# EAGLE design le_strum (EAGLE 5.10)
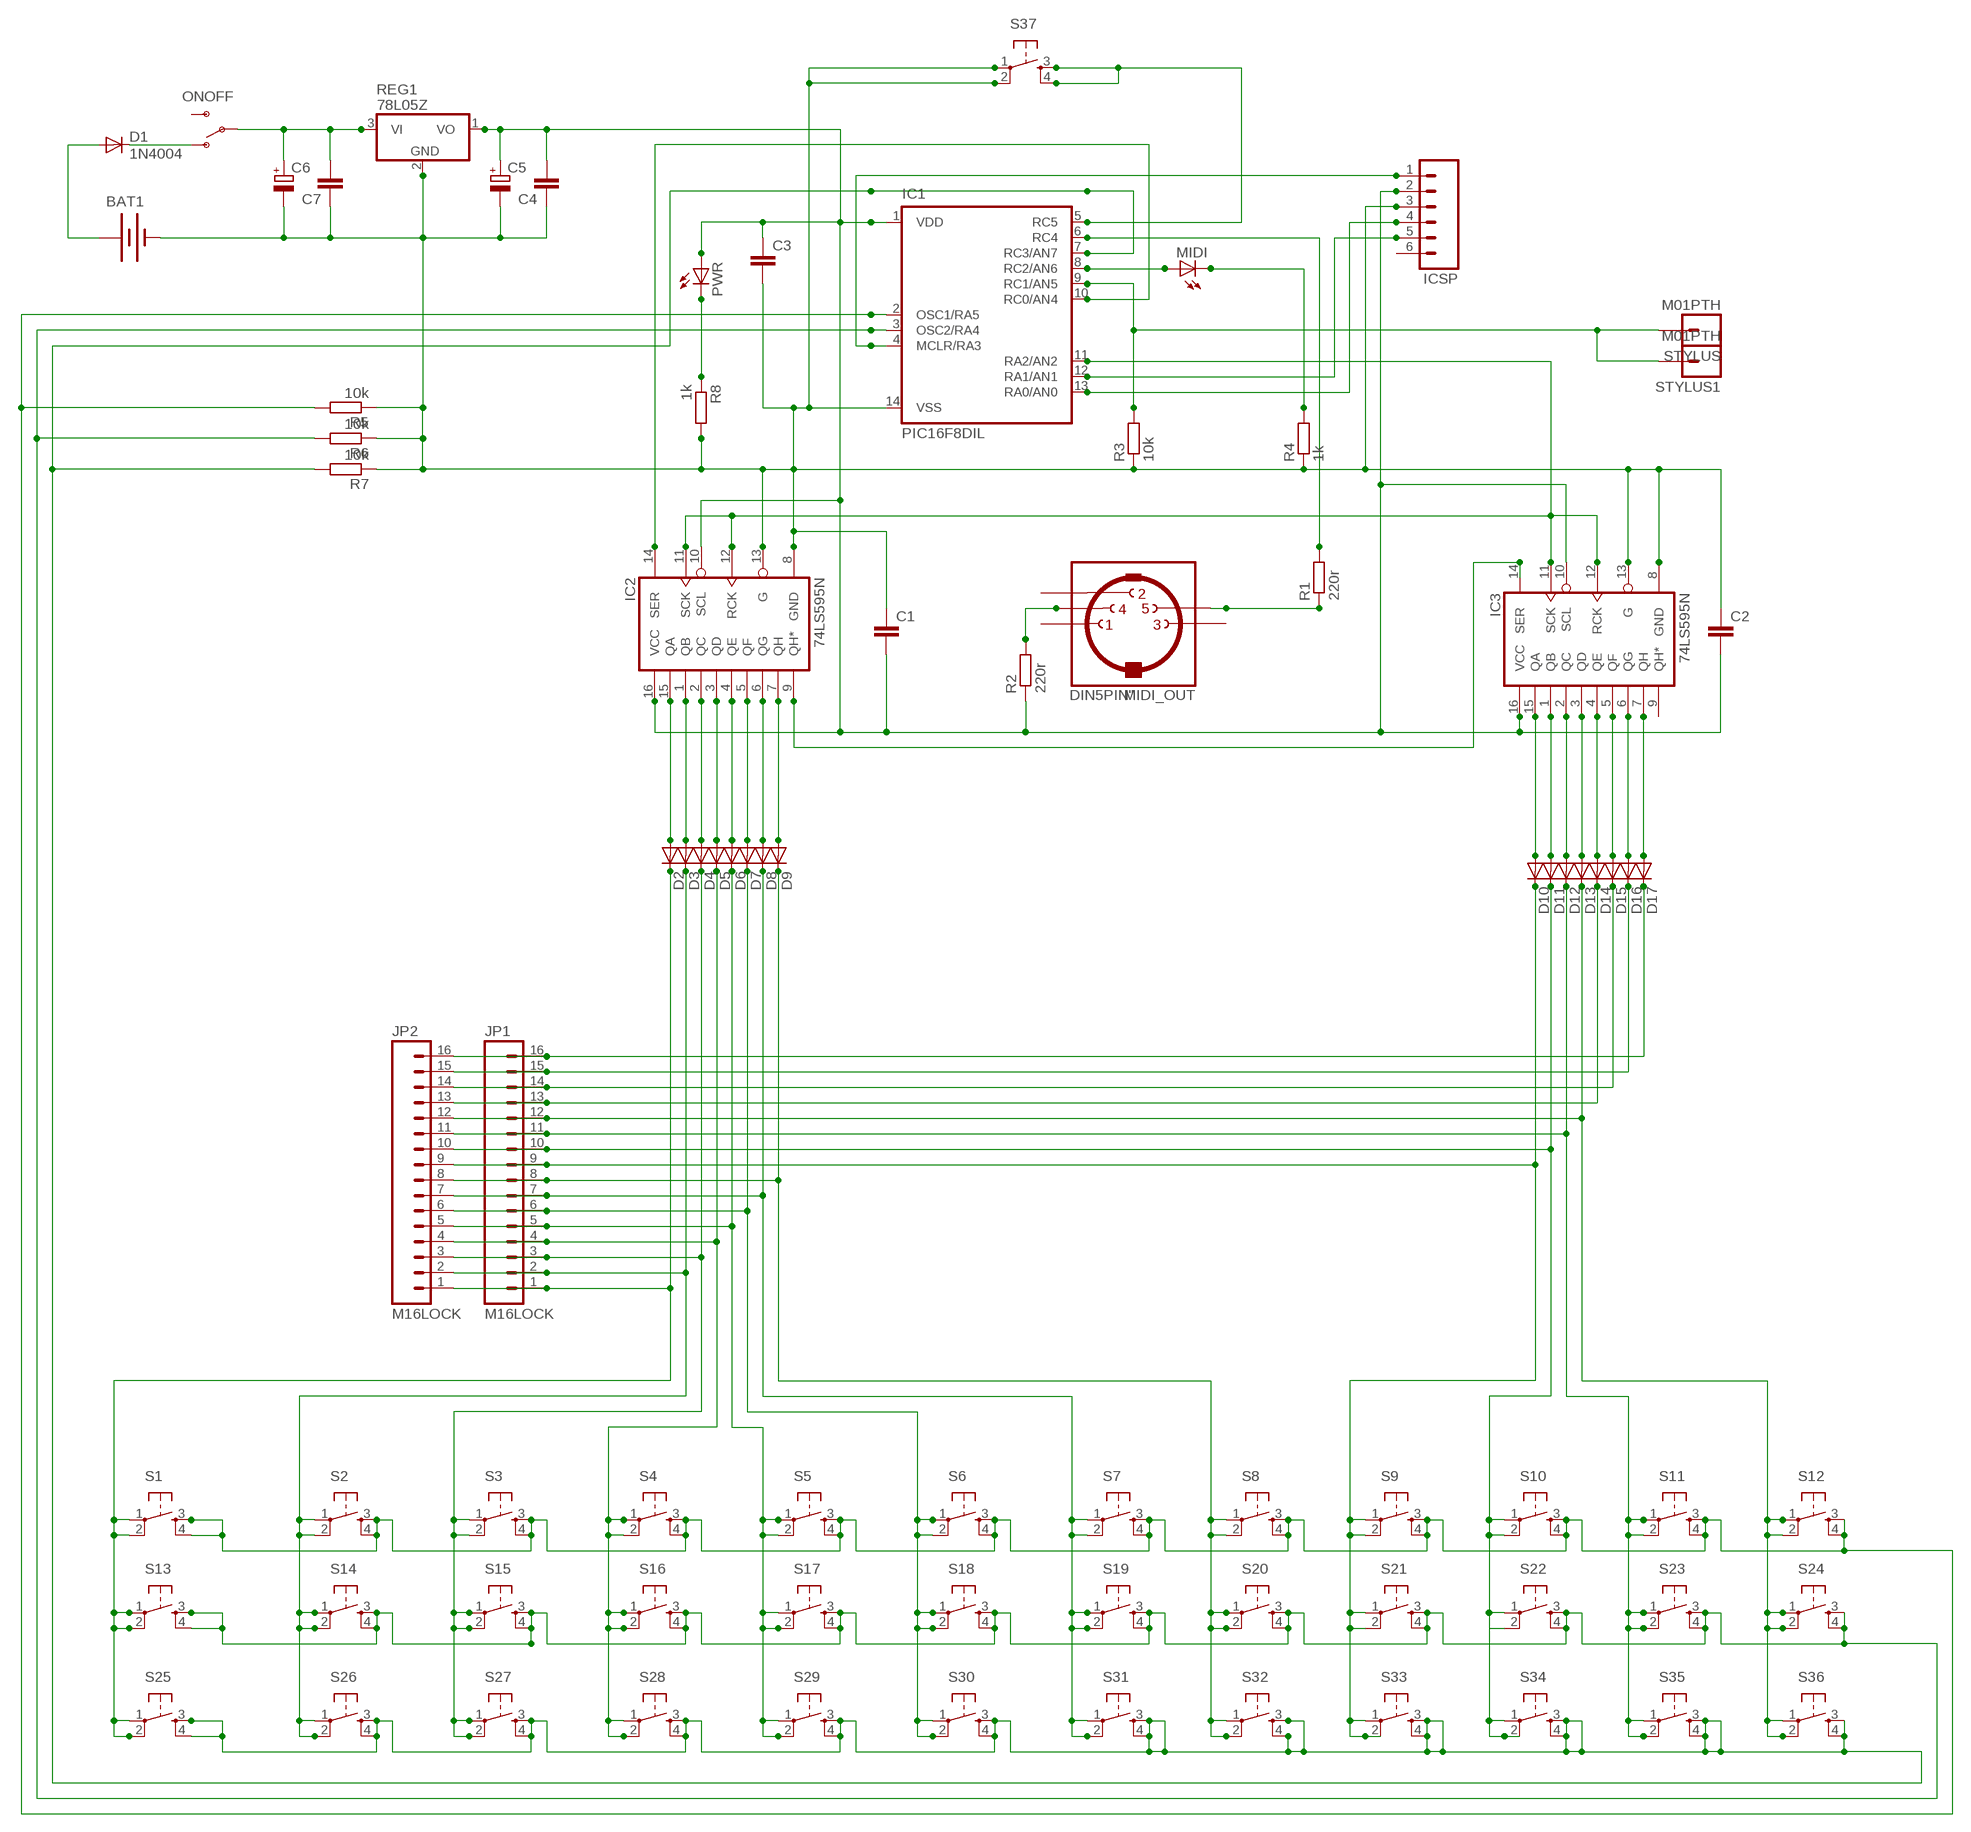
[diagram p0: schematic, sheet 1]

## Parts
BAT1  BATTERY2HOLES  [PP3_BATTERBOX2]
C1  C-EU025-024X044  [C025-024X044]
C2  C-EU025-024X044  [C025-024X044]
C3  C-EU025-024X044  [C025-024X044]
C4  C-EU025-024X044  [C025-024X044]
C5  CPOL-EUE2-5  [E2-5]
C6  CPOL-EUE2-5  [E2-5]
C7  C-EU025-024X044  [C025-024X044]
D1  1N4004  [DO41-10]
D2  DIODE-D-5  [D-5]
D3  DIODE-D-5  [D-5]
D4  DIODE-D-5  [D-5]
D5  DIODE-D-5  [D-5]
D6  DIODE-D-5  [D-5]
D7  DIODE-D-5  [D-5]
D8  DIODE-D-5  [D-5]
D9  DIODE-D-5  [D-5]
D10  DIODE-D-5  [D-5]
D11  DIODE-D-5  [D-5]
D12  DIODE-D-5  [D-5]
D13  DIODE-D-5  [D-5]
D14  DIODE-D-5  [D-5]
D15  DIODE-D-5  [D-5]
D16  DIODE-D-5  [D-5]
D17  DIODE-D-5  [D-5]
IC1  PIC16F8DIL  [DIL14]
IC2  74LS595N  [DIL16]
IC3  74LS595N  [DIL16]
ICSP  M06SIP  [1X06]
JP1  M16LOCK  [1X16_LOCK]
JP2  M16LOCK  [1X16_LOCK]
MIDI  LED3MM  [LED3MM]
MIDI_OUT  DIN5PIN"  [TRUCONN90]
ONOFF  SWITCH-SPSTPTH  [SWITCH-SPDT]
PWR  LED3MM  [LED3MM]
R1  220r  R-EU_0207/7  [0207/7]
R2  220r  R-EU_0207/7  [0207/7]
R3  10k  R-EU_0207/7  [0207/7]
R4  1k  R-EU_0207/7  [0207/7]
R5  10k  R-EU_0207/7  [0207/7]
R6  10k  R-EU_0207/7  [0207/7]
R7  10k  R-EU_0207/7  [0207/7]
R8  1k  R-EU_0207/7  [0207/7]
REG1  78L05Z  [TO92]
S1  TAC_SWITCHPTH  [TACTILE-PTH]
S2  TAC_SWITCHPTH  [TACTILE-PTH]
S3  TAC_SWITCHPTH  [TACTILE-PTH]
S4  TAC_SWITCHPTH  [TACTILE-PTH]
S5  TAC_SWITCHPTH  [TACTILE-PTH]
S6  TAC_SWITCHPTH  [TACTILE-PTH]
S7  TAC_SWITCHPTH  [TACTILE-PTH]
S8  TAC_SWITCHPTH  [TACTILE-PTH]
S9  TAC_SWITCHPTH  [TACTILE-PTH]
S10  TAC_SWITCHPTH  [TACTILE-PTH]
S11  TAC_SWITCHPTH  [TACTILE-PTH]
S12  TAC_SWITCHPTH  [TACTILE-PTH]
S13  TAC_SWITCHPTH  [TACTILE-PTH]
S14  TAC_SWITCHPTH  [TACTILE-PTH]
S15  TAC_SWITCHPTH  [TACTILE-PTH]
S16  TAC_SWITCHPTH  [TACTILE-PTH]
S17  TAC_SWITCHPTH  [TACTILE-PTH]
S18  TAC_SWITCHPTH  [TACTILE-PTH]
S19  TAC_SWITCHPTH  [TACTILE-PTH]
S20  TAC_SWITCHPTH  [TACTILE-PTH]
S21  TAC_SWITCHPTH  [TACTILE-PTH]
S22  TAC_SWITCHPTH  [TACTILE-PTH]
S23  TAC_SWITCHPTH  [TACTILE-PTH]
S24  TAC_SWITCHPTH  [TACTILE-PTH]
S25  TAC_SWITCHPTH  [TACTILE-PTH]
S26  TAC_SWITCHPTH  [TACTILE-PTH]
S27  TAC_SWITCHPTH  [TACTILE-PTH]
S28  TAC_SWITCHPTH  [TACTILE-PTH]
S29  TAC_SWITCHPTH  [TACTILE-PTH]
S30  TAC_SWITCHPTH  [TACTILE-PTH]
S31  TAC_SWITCHPTH  [TACTILE-PTH]
S32  TAC_SWITCHPTH  [TACTILE-PTH]
S33  TAC_SWITCHPTH  [TACTILE-PTH]
S34  TAC_SWITCHPTH  [TACTILE-PTH]
S35  TAC_SWITCHPTH  [TACTILE-PTH]
S36  TAC_SWITCHPTH  [TACTILE-PTH]
S37  TAC_SWITCHPTH  [TACTILE-PTH]
STYLUS  M01PTH  [1X01]
STYLUS1  M01PTH  [1X01]

## Nets
CARRY: IC2.9(QH*) IC3.14(SER)
CLK: IC1.11(RA2/AN2) IC2.11(SCK) IC2.12(RCK) IC3.11(SCK) IC3.12(RCK)
GND: BAT1.0V(-) C1.1 C2.1 C3.2 C4.1 C5.- C6.- C7.1 IC1.14(VSS) IC2.8(GND) IC2.13(G) IC3.8(GND) IC3.13(G) ICSP.3 R3.1 R4.1 R5.1 R6.1 R7.1 R8.2 REG1.2(GND) S37.1 S37.2
LINE1: D2.C JP1.1 JP2.1 S1.1 S1.2 S13.1 S13.2 S25.1 S25.2
LINE2: D3.C JP1.2 JP2.2 S2.1 S2.2 S14.1 S14.2 S26.1 S26.2
LINE3: D4.C JP1.3 JP2.3 S3.1 S3.2 S15.1 S15.2 S27.1 S27.2
LINE4: D5.C JP1.4 JP2.4 S4.1 S4.2 S16.1 S16.2 S28.1 S28.2
LINE5: D6.C JP1.5 JP2.5 S5.1 S5.2 S17.1 S17.2 S29.1 S29.2
LINE6: D7.C JP1.6 JP2.6 S6.1 S6.2 S18.1 S18.2 S30.1 S30.2
LINE7: D8.C JP1.7 JP2.7 S7.1 S7.2 S19.1 S19.2 S31.1 S31.2
LINE8: D9.C JP1.8 JP2.8 S8.1 S8.2 S20.1 S20.2 S32.1 S32.2
LINE9: D10.C JP1.9 JP2.9 S9.1 S9.2 S21.1 S21.2 S33.1 S33.2
LINE10: D11.C JP1.10 JP2.10 S10.1 S10.2 S22.1 S22.2 S34.1 S34.2
LINE11: D12.C JP1.11 JP2.11 S11.1 S11.2 S23.1 S23.2 S35.1 S35.2
LINE12: D13.C JP1.12 JP2.12 S12.1 S12.2 S24.1 S24.2 S36.1 S36.2
LINE13: D14.C JP1.13 JP2.13
LINE14: D15.C JP1.14 JP2.14
LINE15: D16.C JP1.15 JP2.15
LINE16: D17.C JP1.16 JP2.16
N$1: IC1.2(OSC1/RA5) R5.2 S1.3 S1.4 S2.3 S2.4 S3.3 S3.4 S4.3 S4.4 S5.3 S5.4 S6.3 S6.4 S7.3 S7.4 S8.3 S8.4 S9.3 S9.4 S10.3 S10.4 S11.3 S11.4 S12.3 S12.4
N$2: BAT1.9V(+) D1.A
N$3: D1.C ONOFF.1(O)
N$4: IC1.13(RA0/AN0) ICSP.4
N$5: D2.A IC2.15(QA)
N$6: D3.A IC2.1(QB)
N$7: D4.A IC2.2(QC)
N$8: D5.A IC2.3(QD)
N$9: D6.A IC2.4(QE)
N$10: D7.A IC2.5(QF)
N$11: D8.A IC2.6(QG)
N$12: IC1.9(RC1/AN5) R3.2 STYLUS1.1 STYLUS.1
N$13: D9.A IC2.7(QH)
N$14: D10.A IC3.15(QA)
N$15: D11.A IC3.1(QB)
N$16: D12.A IC3.2(QC)
N$17: D13.A IC3.3(QD)
N$18: D14.A IC3.4(QE)
N$19: D15.A IC3.5(QF)
N$20: D16.A IC3.6(QG)
N$21: D17.A IC3.7(QH)
N$22: IC1.5(RC5) S37.3 S37.4
N$23: IC1.7(RC3/AN7) R7.2 S25.3 S25.4 S26.3 S26.4 S27.3 S27.4 S28.3 S28.4 S29.3 S29.4 S30.3 S30.4 S31.3 S31.4 S32.3 S32.4 S33.3 S33.4 S34.3 S34.4 S35.3 S35.4 S36.3 S36.4
N$34: IC1.10(RC0/AN4) IC2.14(SER)
N$35: IC1.4(MCLR/RA3) ICSP.1
N$38: IC1.8(RC2/AN6) MIDI.A
N$42: IC1.12(RA1/AN1) ICSP.5
N$44: MIDI_OUT.5 R1.1
N$46: IC1.6(RC4) R1.2
N$48: MIDI_OUT.4 R2.2
N$50: IC1.3(OSC2/RA4) R6.2 S13.3 S13.4 S14.3 S14.4 S15.3 S15.4 S16.3 S16.4 S17.3 S17.4 S18.3 S18.4 S19.3 S19.4 S20.3 S20.4 S21.3 S21.4 S22.3 S22.4 S23.3 S23.4 S24.3 S24.4
N$52: MIDI.K(C) R4.2
N$54: PWR.K(C) R8.1
N$59: C6.+ C7.2 ONOFF.2(P) REG1.3(VI)
VCC: C1.2 C2.2 C3.1 C4.2 C5.+ IC1.1(VDD) IC2.10(SCL) IC2.16(VCC) IC3.10(SCL) IC3.16(VCC) ICSP.2 PWR.A R2.1 REG1.1(VO)
Unconnected: IC3.9(QH*) ICSP.6 MIDI_OUT.1 MIDI_OUT.2 MIDI_OUT.3 ONOFF.3(S)

## Library data of the parts
BAT1 = jasons_stuff:BATTERY: Battery Holders Various common sizes : AA, AAA, 20mm coin cell and 12mm coin cell.
C1-C4 C7 = rcl:C-EU: CAPACITOR, European symbol
C5 C6 = rcl:CPOL-EU: POLARIZED CAPACITOR, European symbol
D1 = diode:1N4004: DIODE general purpose rectifier, 1 A
D2-D17 = diode:DIODE-: DIODE
IC1 = pic16f6xx_14pin:PIC16F8*: MICROCONTROLLER 14-Pin, 8-Bit PIC16F8X Family - CMOS Flash Pin Compatible : 16F630, 16F676, 16F684, 16F688 Keywords: PIC16F630, PIC16F676, PIC16F684, PIC16F688
IC2 IC3 = SparkFun:74*595: 8-bit SHIFT REGISTER, output latch
ICSP = SparkFun:M06: Header 6 Standard 6-pin 0.1" header. Use with straight break away headers (SKU : PRT-00116), right angle break away headers (PRT-00553), swiss pins (PRT-00743), machine pins (PRT-00117), and female headers (PRT-00115). Molex polarized connector foot print use with SKU : PRT-08094 with associated crimp pins and housings. NOTES ON THE VARIANTS LOCK and LOCK_LONGPADS... This footprint was designed to help hold the alignment of a through-hole component (i.e. 6-pin header) while soldering it into place. You may notice that each hole has been shifted either up or down by 0.005 of an inch from it's more standard position (which is a perfectly straight line). This slight alteration caused the pins (the squares in the middle) to touch the edges of the holes. Because they are alternating, it causes a "brace" to hold the component in place. 0.005 has proven to be the perfect amount of "off-center" position when using our standard breakaway headers. Although looks a little odd when you look at the bare footprint, once you have a header in there, the alteration is very hard to notice. Also, if you push a header all the way into place, it is covered up entirely on the bottom side. This idea of altering the position of holes to aid alignment will be further integrated into the Sparkfun Library for other footprints. It can help hold any component with 3 or more connection pins.
JP1 JP2 = SparkFun:M16
MIDI PWR = led:LED: LED OSRAM: - CHIPLED LG R971, LG N971, LY N971, LG Q971, LY Q971, LO R971, LY R971 LH N974, LH R974 LS Q976, LO Q976, LY Q976 LO Q996 - Hyper CHIPLED LW Q18S LB Q993, LB Q99A, LB R99A - SideLED LS A670, LO A670, LY A670, LG A670, LP A670 LB A673, LV A673, LT A673, LW A673 LH A674 LY A675 LS A676, LA A676, LO A676, LY A676, LW A676 LS A679, LY A679, LG A679 - Hyper Micro SIDELED® LS Y876, LA Y876, LO Y876, LY Y876 LT Y87S - SmartLED LW L88C, LW L88S LB L89C, LB L89S, LG L890 LS L89K, LO L89K, LY L89K LS L896, LA L896, LO L896, LY L896 - TOPLED LS T670, LO T670, LY T670, LG T670, LP T670 LSG T670, LSP T670, LSY T670, LOP T670, LYG T670 LG T671, LOG T671, LSG T671 LB T673, LV T673, LT T673, LW T673 LH T674 LS T676, LA T676, LO T676, LY T676, LB T676, LH T676, LSB T676, LW T676 LB T67C, LV T67C, LT T67C, LS T67K, LO T67K, LY T67K, LW E67C LS E67B, LA E67B, LO E67B, LY E67B, LB E67C, LV E67C, LT E67C LW T67C LS T679, LY T679, LG T679 LS T770, LO T770, LY T770, LG T770, LP T770 LB T773, LV T773, LT T773, LW T773 LH T774 LS E675, LA E675, LY E675, LS T675 LS T776, LA T776, LO T776, LY T776, LB T776 LHGB T686 LT T68C, LB T68C - Hyper Mini TOPLED® LB M676 - Mini TOPLED Santana® LG M470 LS M47K, LO M47K, LY M47K Source: http://www.osram.convergy.de LUXEON: - LUMILED® LXK2-PW12-R00, LXK2-PW12-S00, LXK2-PW14-U00, LXK2-PW14-V00 LXK2-PM12-R00, LXK2-PM12-S00, LXK2-PM14-U00 LXK2-PE12-Q00, LXK2-PE12-R00, LXK2-PE12-S00, LXK2-PE14-T00, LXK2-PE14-U00 LXK2-PB12-K00, LXK2-PB12-L00, LXK2-PB12-M00, LXK2-PB14-N00, LXK2-PB14-P00, LXK2-PB14-Q00 LXK2-PR12-L00, LXK2-PR12-M00, LXK2-PR14-Q00, LXK2-PR14-R00 LXK2-PD12-Q00, LXK2-PD12-R00, LXK2-PD12-S00 LXK2-PH12-R00, LXK2-PH12-S00 LXK2-PL12-P00, LXK2-PL12-Q00, LXK2-PL12-R00 Source: www.luxeon.com KINGBRIGHT: KA-3528ASYC Source: www.kingbright.com
MIDI_OUT = jasons_stuff:DIN5PIN: Female CONNECTOR 5 pins 90 deg. with shield, horizontal (DIN 41524)
ONOFF = SparkFun:SWITCH-SPST: SPST Switch Simple slide switch. Spark Fun Electronics SKU : COM-00102
R1-R8 = resistor:R-EU_: RESISTOR, European symbol
REG1 = adafruit:78*: Positive VOLTAGE REGULATOR Added bigger pads to the TO-92 package
S1-S37 = SparkFun:TAC_SWITCH: Momentary Switch Button commonly used for reset or general input. Spark Fun Electronics SKU : COM-00097
STYLUS STYLUS1 = SparkFun:M01: Header 1 Standard 1-pin 0.1" header. Use with straight break away headers (SKU : PRT-00116), right angle break away headers (PRT-00553), swiss pins (PRT-00743), machine pins (PRT-00117), and female headers (PRT-00115).

## Board
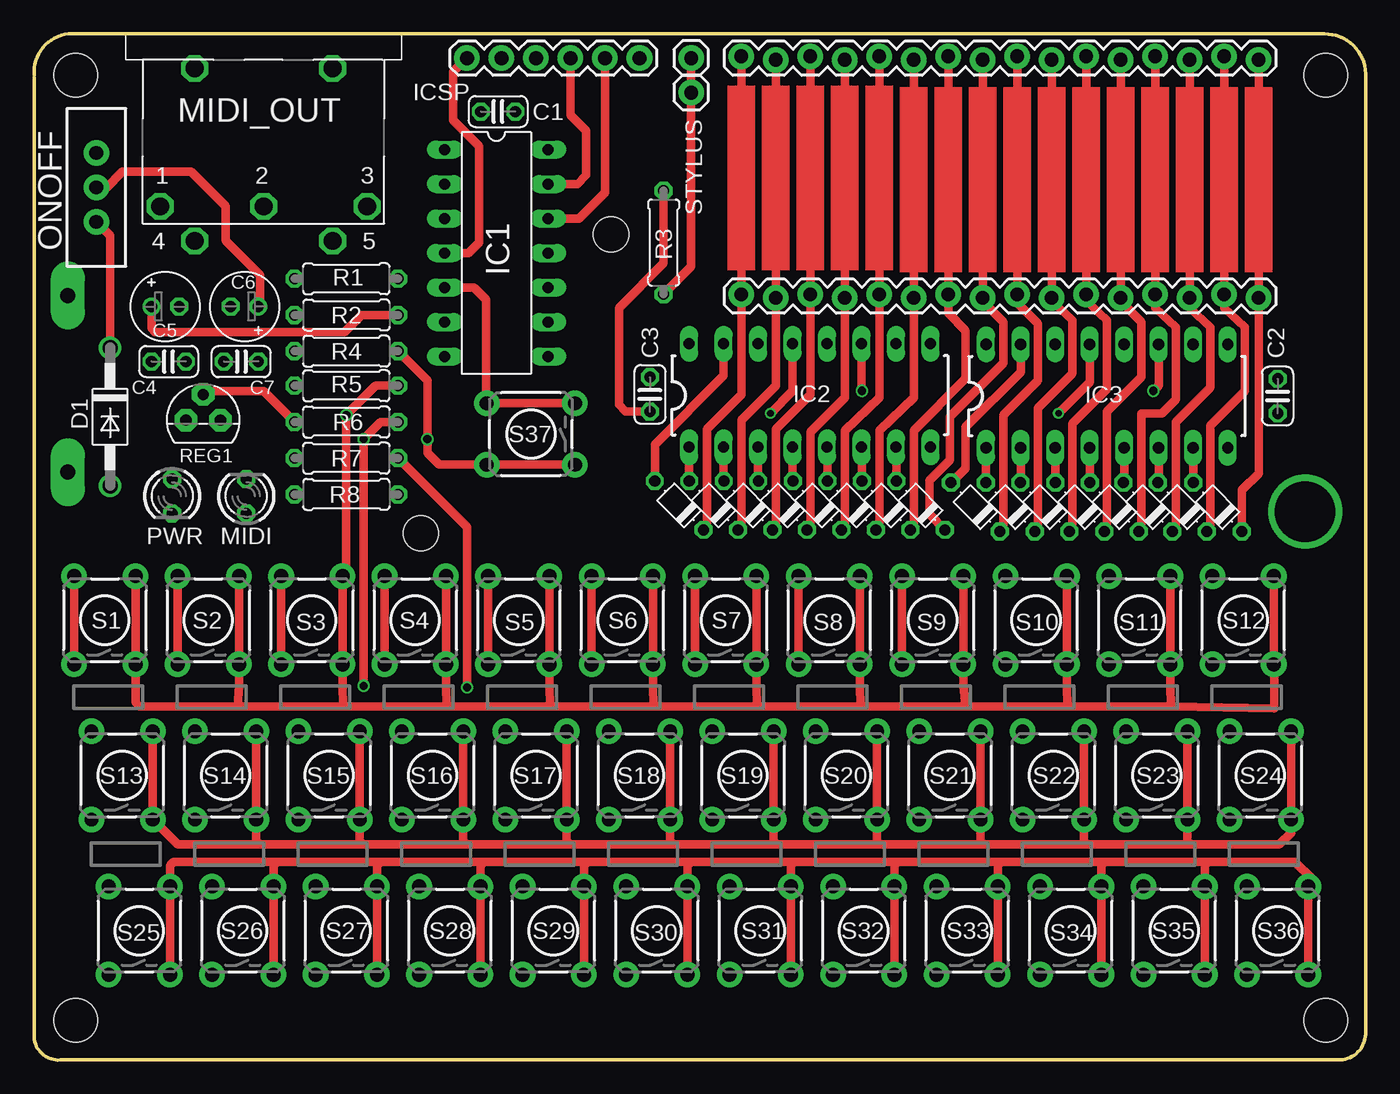
[diagram p1: board, top side]
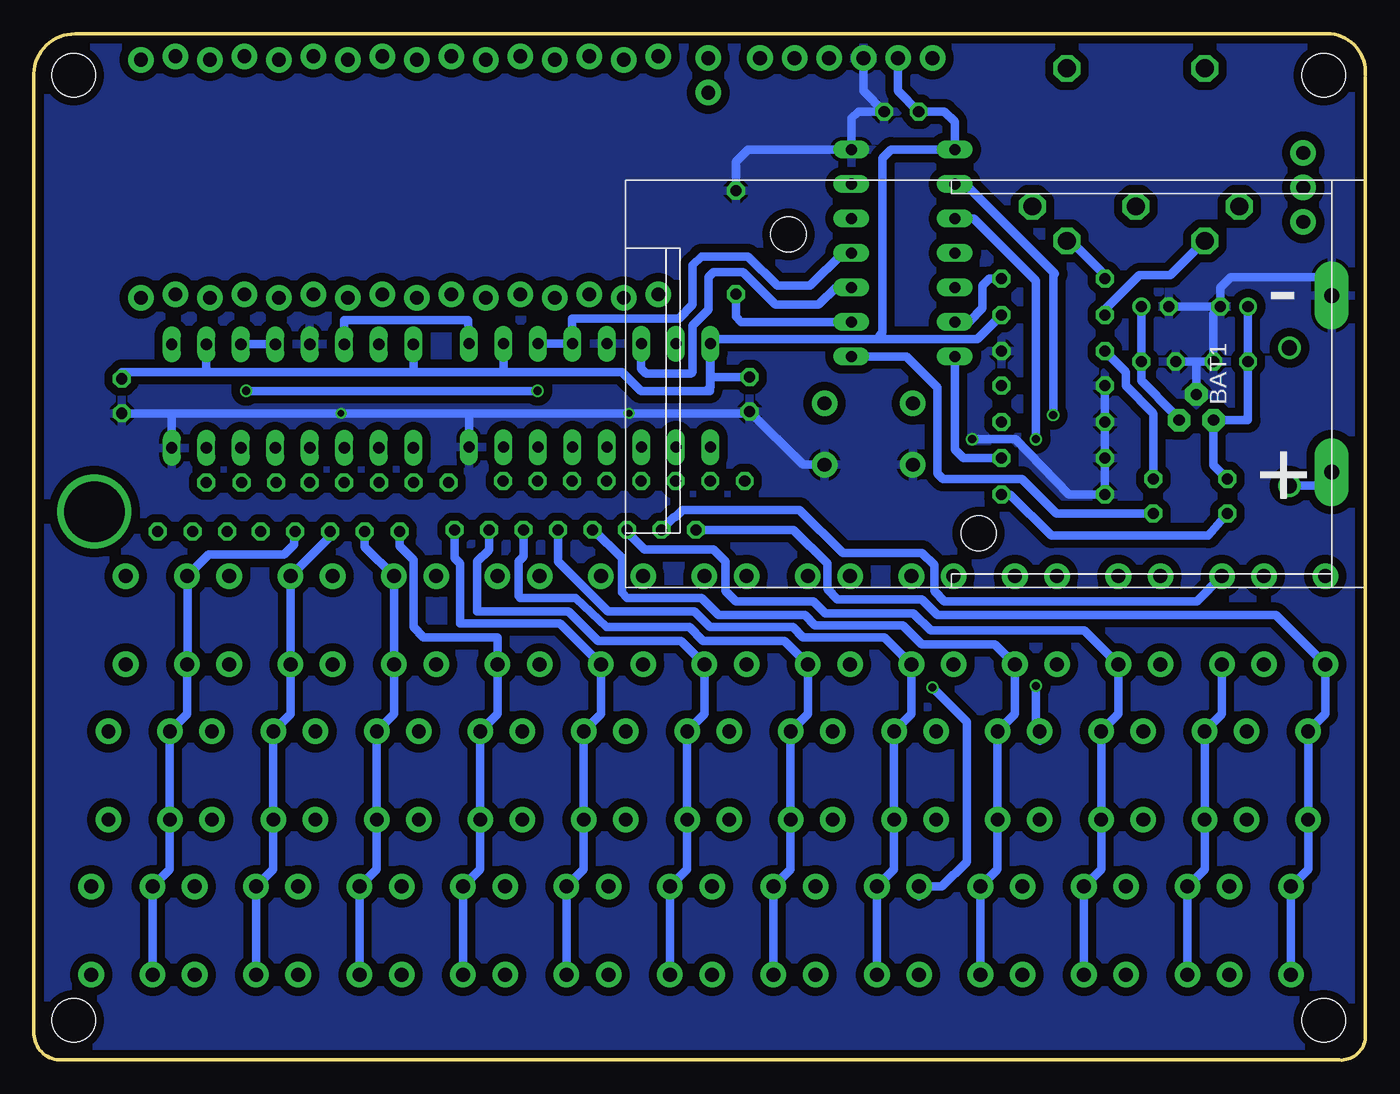
[diagram p2: board, bottom side, seen from below]

Size 98.06 x 75.57 mm. Coordinates in mm from the lower left corner, seen from the top.
Outline: 0.01,72.52 arc-90 2.55,75.57 95.01,75.57 arc-90 98.06,72.65 98.06,1.91 arc-90 96.02,0 1.92,0 arc-90 0.01,1.66 0.01,72.39
Copper layers (1*16): Top 0.035mm / dielectric 1.5mm / Bottom 0.035mm
Design rules "ITEADstudio_DRC": minimum track width 6mil, minimum drill 12mil, track to track 6mil, track to pad 6mil, pad to pad 6mil, via to via 6mil, smd to smd 0mil, copper to edge 10mil, drill to drill 10mil, minimum pad ring 10mil, minimum via ring 6mil, stop-mask expansion 2mil, vias tented up to drill 100mil, thermal gap 10mil
Holes 3.2 mm at 3.06,72.52 95.13,72.52 3.06,2.93 95.13,2.93

### Footprints (pad centres in the part's own frame; a part is rotated, then mirrored left to right if it is on the bottom)
PP3_BATTERBOX2 = drill 1.1 pad 2.5 long: 0V 52,21.5; 9V 52,8.5 | hole 2.6: 12,26; 26,4
C025-024X044 = drill 0.813 octagon: 1 -1.27,0; 2 1.27,0
E2-5 = drill 0.813 pad 1.27 round: + -1.016,0 | drill 0.813 pad 1.27 octagon: - 1.016,0
DO41-10 = drill 1.118 round: A 5.08,0; C -5.08,0
D-5 = drill 0.813 octagon: A 2.54,0; C -2.54,0
DIL14 = drill 0.813 long: 1 -10.16,-3.81; 2 -7.62,-3.81; 3 -5.08,-3.81; 4 -2.54,-3.81; 5 0,-3.81; 6 2.54,-3.81; 7 5.08,-3.81; 8 5.08,3.81; 9 2.54,3.81; 10 0,3.81; 11 -2.54,3.81; 12 -5.08,3.81; 13 -7.62,3.81; 14 -10.16,3.81
DIL16 = drill 0.813 long: 1 -8.89,-3.81; 2 -6.35,-3.81; 3 -3.81,-3.81; 4 -1.27,-3.81; 5 1.27,-3.81; 6 3.81,-3.81; 7 6.35,-3.81; 8 8.89,-3.81; 9 8.89,3.81; 10 6.35,3.81; 11 3.81,3.81; 12 1.27,3.81; 13 -1.27,3.81; 14 -3.81,3.81; 15 -6.35,3.81; 16 -8.89,3.81
1X06 = drill 1.016 pad 1.88 round: 1 0,0; 2 2.54,0; 3 5.08,0; 4 7.62,0; 5 10.16,0; 6 12.7,0
1X16_LOCK = drill 1.016 pad 1.88 round: 1 0,0.127; 2 2.54,-0.127; 3 5.08,0.127; 4 7.62,-0.127; 5 10.16,0.127; 6 12.7,-0.127; 7 15.24,0.127; 8 17.78,-0.127; 9 20.32,0.127; 10 22.86,-0.127; 11 25.4,0.127; 12 27.94,-0.127; 13 30.48,0.127; 14 33.02,-0.127; 15 35.56,0.127; 16 38.1,-0.127
LED3MM = drill 0.813 octagon: A -1.27,0; K 1.27,0
TRUCONN90 = drill 1.321 octagon: 1 7.62,5.08; 2 0,5.08; 3 -7.62,5.08; 4 5.08,7.62; 5 -5.08,7.62; NC -5.08,-5.08; NC@ 5.08,-5.08
SWITCH-SPDT = drill 1.016 pad 1.88 round: 1 0,2.54; 2 0,0; 3 0,-2.54
0207/7 = drill 0.813 octagon: 1 -3.81,0; 2 3.81,0
TO92 = drill 0.813 pad 1.676 octagon: 1 -1.27,0; 2 0,1.905; 3 1.27,0
TACTILE-PTH = drill 1.016 pad 1.88 round: 1 -3.251,2.261; 2 3.251,2.261; 3 -3.251,-2.261; 4 3.251,-2.261
1X01 = drill 1.016 pad 1.88 round: 1 0,0

### Placement (x,y rotation side)
BAT1  54.49,34.8 0 bottom
C1  34.17,69.85 180 top
C2  91.58,48.9 90 top
C3  45.35,49.03 270 top
C4  9.92,51.44 180 top
C5  9.66,55.5 0 top
C6  15.51,55.5 180 top
C7  15.25,51.44 0 top
D1  5.6,47.38 270 top
D2  47.51,40.85 135 top
D3  50.05,40.85 135 top
D4  52.59,40.85 135 top
D5  55.13,40.85 135 top
D6  57.67,40.85 135 top
D7  60.21,40.85 135 top
D8  62.75,40.85 135 top
D9  65.29,40.85 135 top
D10  69.33,40.72 135 top
D11  71.89,40.72 135 top
D12  74.43,40.72 135 top
D13  77.02,40.72 135 top
D14  79.56,40.72 135 top
D15  82.03,40.72 135 top
D16  84.57,40.72 135 top
D17  87.16,40.72 135 top
IC1  34.05,56.9 270 top
IC2  57.14,48.95 0 top
IC3  79.01,48.9 0 top
ICSP  31.89,73.79 0 top
JP1  52.08,73.79 0 top
JP2  52.08,56.27 0 top
MIDI  15.63,41.53 90 top
MIDI_OUT  16.9,67.95 180 top
ONOFF  4.58,64.27 180 top
PWR  10.17,41.53 270 top
R1  23,57.54 0 top
R2  23,54.87 180 top
R3  46.37,60.2 270 top
R4  23,52.2 180 top
R5  23,49.66 0 top
R6  23,46.99 0 top
R7  23,44.33 0 top
R8  23,41.66 180 top
REG1  12.46,47.12 0 top
S1  5.22,32.39 90 top
S2  12.84,32.39 90 top
S3  20.46,32.39 90 top
S4  28.08,32.39 90 top
S5  35.7,32.39 90 top
S6  43.32,32.39 90 top
S7  50.94,32.39 90 top
S8  58.56,32.39 90 top
S9  66.18,32.39 90 top
S10  73.8,32.39 90 top
S11  81.42,32.39 90 top
S12  89.04,32.39 90 top
S13  6.49,20.96 90 top
S14  14.11,20.96 90 top
S15  21.73,20.96 90 top
S16  29.35,20.96 90 top
S17  36.97,20.96 90 top
S18  44.59,20.96 90 top
S19  52.21,20.96 90 top
S20  59.83,20.96 90 top
S21  67.45,20.96 90 top
S22  75.07,20.96 90 top
S23  82.69,20.96 90 top
S24  90.31,20.96 90 top
S25  7.76,9.53 90 top
S26  15.38,9.53 90 top
S27  23,9.53 90 top
S28  30.62,9.53 90 top
S29  38.24,9.53 90 top
S30  45.86,9.53 90 top
S31  53.48,9.53 90 top
S32  61.1,9.53 90 top
S33  68.72,9.53 90 top
S34  76.34,9.53 90 top
S35  83.96,9.53 90 top
S36  91.58,9.53 90 top
S37  36.59,46.11 180 top
STYLUS  48.4,73.79 0 top
STYLUS1  48.4,71.25 0 top

### Tracks (layer width: path | path; a pad name or v marks a point on that pad's centre or on a via)
CARRY
  Bottom 0.61: IC3.14 75.2,54.49 66.1,54.49 IC2.9
CLK  (via drill 0.6)
  Top 0.61: IC2.11 60.95,49.31 v60.97,49.28 | v82.43,49.28 82.82,49.66 IC3.11
  Bottom 0.61: IC2.11 IC2.12 58.43,52.79 58.43,54.61 50.56,54.61 49.54,55.63 49.54,58.55 48.91,59.19 45.48,59.19 43.32,57.03 40.91,57.03 38.49,59.44 IC1.11 | IC3.11 IC3.12 | v60.97,49.28 v82.43,49.28
GND  (via drill 0.5, 0.6)
  Top 0.61: IC3.13 77.74,49.92 v75.45,47.63 | IC2.13 55.87,49.26 v54.24,47.63 | S37.1 S37.2 29.83,43.84 28.97,44.71 v28.97,45.72 28.97,50.04 R4.1 | R3.1 46.37,58.68 43.06,55.38 43.06,48.26 43.57,47.76 C3.2 | R6.1 16.9,49.28 12.71,49.28 REG1.2
  Bottom 0.61: 66.03,47.48 IC2.8 | 66.03,47.48 66.18,47.63 v75.45,47.63 87.77,47.63 | 66.03,47.48 66.03,47.6 66.05,47.63 v54.24,47.63 45.48,47.63 C3.2 41.44,43.84 S37.1 | 87.77,47.63 C2.1 | IC3.8 87.9,47.5 87.77,47.63 | ICSP.3 36.97,71.38 C1.1 37.35,69.85 37.86,69.35 IC1.14 45.48,67.06 46.37,66.17 R3.1 | BAT1.0V 1.74,56.22 3.19,57.66 9.92,57.66 10.68,56.9 C5.- | C5.- C6.- | C5.- 11.19,55 C4.1 12.33,51.44 | 12.33,51.44 C7.1 | R6.1 R7.1 R8.2 | R6.1 R8.2 | R8.2 21.86,41.66 25.79,45.72 v28.97,45.72 | REG1.2 12.46,51.31 12.33,51.44 | R6.1 R5.1
  pour Bottom (isolate 0.61): 0.65,70.24 0.65,72.52 3.19,75.06 94.12,75.06 97.42,71.76 97.42,3.69 94.37,0.64 3.69,0.64 0.65,3.69
LINE1
  Top 0.61: S1.1 S1.2 | JP1.1 JP2.1 52.08,49.03 49.54,46.49 49.54,39.29 D2.C
  Bottom 0.61: S25.1 S25.2 4.23,14.05 S13.1 S13.2 2.96,25.48 S1.1 6.59,32.77 31.51,32.77 32.65,33.91 38.87,33.91 39.64,34.68 39.64,36.58 42.11,39.05 D2.C
LINE2
  Top 0.61: S2.1 S2.2 | JP1.2 JP2.2 54.62,49.66 52.08,47.12 52.08,39.29 D3.C
  Bottom 0.61: S2.1 10.58,25.48 S14.2 S14.1 11.85,14.05 S26.2 S26.1 | D3.C 51.85,39.1 50.94,40.01 50.81,40.01 50.3,40.52 41.67,40.52 38.49,37.34 32.65,37.34 31.76,36.45 31.76,34.55 31,33.79 12.43,33.79 S2.2
LINE3
  Top 0.61: S3.1 S3.2 | JP1.3 JP2.3 57.16,49.03 54.62,46.49 54.62,39.29 D4.C
  Bottom 0.61: S27.1 S27.2 19.47,14.05 S15.1 S15.2 18.2,25.48 S3.1 20.69,31.63 32.02,31.63 33.29,32.9 39.76,32.9 40.65,33.79 46.37,33.79 47.13,34.55 47.13,36.71 48.02,37.6 53.1,37.6 54.39,38.88 D4.C
LINE4
  Top 0.61: S4.1 S4.2 | JP1.4 JP2.4 59.7,48.77 57.16,46.23 57.16,39.29 D5.C
  Bottom 0.61: S28.1 S28.2 27.09,14.05 S16.1 S16.2 25.82,25.48 S4.1 27.29,30.61 32.65,30.61 34.05,32.01 40.52,32.01 41.29,32.77 47.64,32.77 48.91,34.04 54.37,34.04 54.75,34.42 54.75,36.96 56.84,39.05 D5.C
LINE5
  Top 0.61: S5.2 S5.1 33.44,28.58 | JP1.5 JP2.5 62.24,48.77 59.7,46.36 59.7,39.41 D6.C
  Bottom 0.61: S29.1 S29.2 34.71,14.05 S17.1 S17.2 33.44,25.48 S5.1 35.42,31.12 41.41,31.12 42.18,31.88 48.27,31.88 49.41,33.02 55.76,33.02 59.45,36.71 59.45,39.03 D6.C
LINE6
  Top 0.61: S6.1 S6.2 | JP1.6 JP2.6 64.78,48.77 62.24,46.36 62.24,39.41 D7.C
  Bottom 0.61: S30.1 S30.2 42.33,14.05 S18.1 S18.2 41.06,25.48 S6.1 42.79,30.87 48.78,30.87 49.8,31.88 55.89,31.88 58.18,34.04 62.24,34.04 62.37,34.17 62.37,36.71 62.01,37.07 D7.C
LINE7
  Top 0.61: S7.1 S7.2 | JP1.7 JP2.7 67.32,55 68.59,53.73 68.59,50.17 64.78,46.36 64.78,39.41 D8.C
  Bottom 0.61: S31.1 S31.2 49.95,14.05 S19.1 S19.2 48.68,25.48 S7.1 50.41,30.87 56.53,30.87 58.69,33.02 65.42,33.02 65.42,36.71 64.55,37.58 D8.C
LINE8
  Top 0.61: JP1.8 JP2.8 69.86,55.88 71.39,54.36 71.39,51.31 67.45,47.38 67.45,44.2 65.92,42.68 65.92,40.21 D9.C | S8.1 S8.2
  Bottom 0.61: S32.1 S32.2 57.57,14.05 S20.1 S20.2 56.3,25.48 S8.1 59.3,32.14 66.69,32.14 66.69,36.58 67.09,36.98 D9.C
LINE9
  Top 0.61: JP1.9 JP2.9 72.4,55.76 73.93,54.23 73.93,50.04 71.39,47.5 71.39,39.06 D10.C | S9.1 S9.2
  Bottom 0.61: S33.1 S33.2 65.19,14.05 S21.1 S21.2 63.92,25.48 S9.1 63.92,31.12 69.35,31.12 70.12,31.88 70.12,36.83 71.12,37.84 D10.C
LINE10
  Top 0.61: JP1.10 JP2.10 74.94,55.88 76.47,54.49 76.47,50.55 73.93,48.01 73.93,39.03 D11.C
  Bottom 0.61: S34.1 S34.2 72.81,14.05 S22.1 S22.2 71.54,25.48 S10.1 S10.2 73.69,37.79 D11.C
LINE11
  Top 0.61: JP1.11 JP2.11 77.48,55.88 79.01,54.49 79.01,49.41 76.47,46.87 76.47,39.16 D12.C
  Bottom 0.61: S35.1 S35.2 80.43,14.05 S23.1 S23.2 79.16,25.48 S11.1 S11.2 76.23,38.57 D12.C
LINE12
  Top 0.61: JP1.12 JP2.12 80.02,55.88 81.55,54.36 81.55,50.3 79.01,47.76 79.01,39.11 D13.C
  Bottom 0.61: S12.1 86.5,29.42 | S12.1 86.75,29.16 86.75,35.62 S12.2 85.2,37.22 79.64,37.22 78.88,37.98 78.88,38.87 D13.C | S12.1 86.78,25.48 S24.2 S24.1 88.05,14.05 S36.2 S36.1
LINE13
  Top 0.61: JP1.13 JP2.13 82.56,55.38 84.09,53.98 84.09,48.65 83.07,47.63 81.55,47.63 81.55,39.11 D14.C
LINE14
  Top 0.61: JP1.14 JP2.14 85.1,55.38 86.63,53.98 86.63,49.53 84.09,46.99 84.09,39.19 D15.C
LINE15
  Top 0.61: JP1.15 JP2.15 87.64,55.38 89.17,53.98 89.17,49.28 86.63,46.74 86.63,39.06 D16.C
LINE16
  Top 0.61: JP1.16 JP2.16 90.18,43.2 88.95,41.97 D17.C
N$1  (via drill 0.6)
  Top 0.61: 15,26.04 7.76,26.04 7.48,26.32 S1.3 S1.4 | 15,26.04 22.74,26.04 | 22.74,26.04 30.36,26.04 | 30.36,26.04 37.98,26.04 | 37.98,26.04 45.6,26.04 | 45.6,26.04 53.22,26.04 | 53.22,26.04 60.84,26.04 | 60.84,26.04 68.59,26.04 | 68.59,26.04 76.08,26.04 | 76.08,26.04 83.7,26.04 | 83.7,26.04 91.32,25.91 91.32,28.99 S12.3 S12.4 | S11.4 S11.3 83.68,27.59 83.7,26.04 | S10.4 S10.3 76.06,27.59 76.08,26.04 | S9.4 S9.3 68.44,27.59 68.59,26.04 | S8.4 S8.3 60.82,27.59 60.84,26.04 | S7.4 S7.3 53.2,27.59 53.22,26.04 | S6.4 S6.3 45.58,27.59 45.6,26.04 | S5.4 S5.3 37.96,27.59 37.98,26.04 | S4.4 S4.3 30.34,27.59 30.36,26.04 | S2.4 S2.3 15.1,27.59 15,26.04 | 22.74,26.04 22.72,27.59 S3.3 S3.4 23,35.92 v23,47.5 25.16,49.66 R5.2
  Bottom 0.61: IC1.2 29.48,64.52 22.87,57.92 23,57.79 v23,47.5
N$2
  Bottom 0.61: D1.A 3,42.3 BAT1.9V
N$3
  Top 0.61: D1.C 5.6,60.71 ONOFF.1
N$4
  Top 0.61: ICSP.4 39.51,69.6 40.65,68.46 40.65,65.16 40.02,64.52 IC1.13
N$5
  Top 0.61: IC2.15 50.79,50.4 45.73,45.34 45.73,42.66 D2.A
N$6
  Top 0.61: IC2.1 48.25,42.65 D3.A
N$7
  Top 0.61: IC2.2 50.79,42.65 D4.A
N$8
  Top 0.61: IC2.3 53.33,42.65 D5.A
N$9
  Top 0.61: IC2.4 55.87,42.65 D6.A
N$10
  Top 0.61: D7.A IC2.5
N$11
  Top 0.61: D8.A IC2.6
N$12
  Top 0.61: STYLUS.1 STYLUS1.1 48.4,58.42 R3.2
  Bottom 0.61: IC1.9 45.99,54.36 46.37,54.74 R3.2
N$13
  Top 0.61: D9.A IC2.7
N$14
  Top 0.61: D10.A 67.54,42.52 68.59,43.57 68.59,46.61 72.66,50.68 IC3.15
N$15
  Top 0.61: IC3.1 70.12,42.53 D11.A
N$16
  Top 0.61: IC3.2 72.66,42.53 D12.A
N$17
  Top 0.61: IC3.3 75.2,42.55 D13.A
N$18
  Top 0.61: IC3.4 77.74,42.55 D14.A
N$19
  Top 0.61: IC3.5 80.28,42.56 D15.A
N$20
  Top 0.61: IC3.6 82.82,42.56 D16.A
N$21
  Top 0.61: IC3.7 D17.A
N$22
  Top 0.61: S37.3 S37.4 33.29,48.42 33.29,56.01 32.4,56.9 IC1.5
N$23  (via drill 0.6)
  Top 0.61: S25.3 S25.4 10.02,14.33 10.3,14.61 17.92,14.61 | S26.3 S26.4 17.64,14.33 17.92,14.61 | S27.3 S27.4 25.26,14.33 25.54,14.61 | S28.3 S28.4 32.88,14.33 33.16,14.61 | S29.3 S29.4 40.5,14.33 40.78,14.61 | S30.3 S30.4 48.12,14.33 48.4,14.61 | S31.3 S31.4 55.74,14.33 56.02,14.61 | S32.3 S32.4 63.36,14.33 63.64,14.61 | S33.3 S33.4 70.98,14.33 71.26,14.61 | S34.3 S34.4 78.6,14.33 78.88,14.61 | S35.3 S35.4 86.22,14.33 86.5,14.61 | S36.3 S36.4 94.12,13.06 94.12,13.34 92.85,14.61 86.5,14.61 | 17.92,14.61 25.54,14.61 | 25.54,14.61 33.16,14.61 | 33.16,14.61 40.78,14.61 | 40.78,14.61 48.4,14.61 | 48.4,14.61 56.02,14.61 | 56.02,14.61 63.64,14.61 | 63.64,14.61 71.26,14.61 | 71.26,14.61 78.88,14.61 | 78.88,14.61 86.5,14.61 | v31.89,27.44 31.89,39.25 R7.2
  Bottom 0.61: S28.4 32.88,12.07 | S28.4 32.88,13.34 | S28.4 31.18,12.78 29.35,14.61 29.35,24.9 v31.89,27.44 | R7.2 29.6,44.33 30.24,44.96 IC1.7
N$24  (via drill 4.45)
  other vias: 93.61,40.39
N$34
  Bottom 0.61: IC2.14 53.35,52.73 53.35,50.93 52.97,50.55 49.67,50.55 49.54,50.68 49.54,54.11 48.4,55.25 48.4,57.66 48.02,58.04 45.86,58.04 43.45,55.63 40.27,55.63 39,56.9 IC1.10
N$35
  Top 0.61: ICSP.1 30.87,72.78 30.87,69.22 32.78,67.31 32.78,60.2 32.02,59.44 IC1.4
N$38
  Bottom 0.61: IC1.8 33.79,51.82 31.51,49.53 31.51,43.18 31.13,42.8 25.28,42.8 22.74,40.26 MIDI.A
N$42
  Top 0.61: IC1.12 40.14,61.98 42.05,63.89 ICSP.5
N$44
  Bottom 0.61: MIDI_OUT.5 21.73,60.33 19.19,57.79 R1.1
N$46
  Bottom 0.61: R1.2 27.7,57.54 28.21,57.03 28.21,55.38 29.22,54.36 IC1.6
N$48
  Bottom 0.61: R2.2 19.19,55.25 16.65,57.79 14.36,57.79 MIDI_OUT.4
N$50  (via drill 0.6)
  Top 0.61: S13.4 S13.3 10.58,15.88 16.65,15.88 | S14.4 S14.3 16.37,16.16 16.65,15.88 | S15.4 S15.3 23.99,16.16 24.27,15.88 | S16.4 S16.3 31.61,16.16 31.89,15.88 | S17.4 S17.3 39.23,16.16 39.51,15.88 | S18.4 S18.3 46.85,16.16 47.13,15.88 | S19.4 S19.3 54.47,16.16 54.75,15.88 | S20.4 S20.3 62.09,16.16 62.37,15.88 | S21.4 S21.3 69.71,16.16 69.99,15.88 | S22.4 S22.3 77.33,16.16 77.61,15.88 | S23.4 S23.3 84.95,16.16 85.23,15.88 | S24.3 S24.4 92.57,16.74 91.71,15.88 85.23,15.88 | 16.65,15.88 24.27,15.88 | 24.27,15.88 31.89,15.88 | 31.89,15.88 39.51,15.88 | 39.51,15.88 47.13,15.88 | 47.13,15.88 54.75,15.88 | 54.75,15.88 62.37,15.88 | 62.37,15.88 69.99,15.88 | 69.99,15.88 77.61,15.88 | 77.61,15.88 85.23,15.88 | v24.27,27.56 v24.27,45.72 25.54,46.99 R6.2
  Bottom 0.61: 24.27,23.78 23.99,23.5 S15.4 24.27,24.49 v24.27,27.56 | v24.27,45.72 24.27,57.41 28.84,61.98 IC1.3
N$52
  Bottom 0.61: MIDI.K 15.63,47.63 17.66,49.66 17.66,50.68 R4.2
N$54
  Bottom 0.61: R8.1 26.17,41.66 23.13,38.61 11.57,38.61 PWR.K
N$59
  Top 0.61: ONOFF.2 5.35,64.27 6.49,65.41 11.57,65.41 14.11,62.87 14.11,60.33 16.65,57.79 16.65,55.63 C6.+
  Bottom 0.61: C6.+ C7.2 16.52,50.04 14.11,47.63 14.11,47.5 REG1.3
VCC
  Top 0.61: R2.1 24.14,54.87 22.87,53.6 8.9,53.6 8.65,53.85 C5.+
  Bottom 0.61: 91.96,50.3 C2.2 91.58,50.68 85.23,50.68 | IC2.16 48.25,50.3 | 48.25,50.3 48.25,49.56 48.53,49.28 | 48.53,49.28 48.27,49.28 48.27,52.76 IC2.16 | 48.53,49.28 53.35,49.28 54.75,50.68 63.64,50.68 | 63.64,50.68 69.99,50.68 | 69.99,50.68 85.23,50.68 | IC2.10 63.49,50.83 63.64,50.68 | IC3.16 70.12,50.8 69.99,50.68 | IC3.10 85.36,50.8 85.23,50.68 | ICSP.2 34.43,71.38 C1.2 31,69.85 30.24,69.09 IC1.1 34.94,67.06 35.57,66.43 35.57,53.6 35.95,53.09 | 35.95,53.09 28.59,53.09 R2.1 | C5.+ C4.2 8.65,47.12 REG1.1 11.19,43.82 PWR.A | 48.25,50.3 C3.1 | 35.95,53.09 47.92,53.09 IC2.16
(copper drawn outside any net)
  shapes: Top area x16

### Text on the board
tDocu: 1 | GND | D2- | D17 | mode | +9V | c | d | e | f | g | a | b | c | d | e | f | g | a | b | maj | min | hotchk155 | 7th | midi strum controller rev 3